# Altium schematic sheet 4G_GATEWAY.SchDoc
size A4
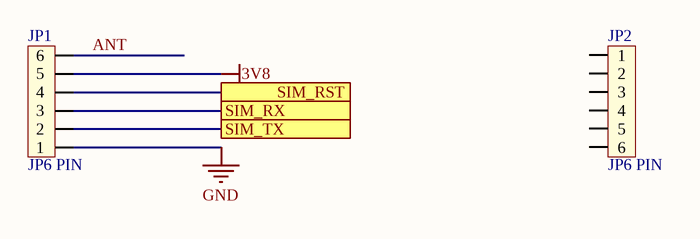
[diagram p0: 4G_GATEWAY.SchDoc]

## Parts
JP1  JP6 PIN  [JP6]
JP2  JP6 PIN  [JP6]

## Ports
SIM_RST, SIM_RX, SIM_TX

## Nets
3V8: JP1.5
GND: JP1.1
ANT: JP1.6
SIM_RST: JP1.4 ; port SIM_RST
SIM_RX: JP1.3 ; port SIM_RX
SIM_TX: JP1.2 ; port SIM_TX

Not connected (* = marked no-connect by the designer): JP2 1 2 3 4 5 6

## Library data of the parts
JP1 JP2 = JP6: Value: JP7